# Altium schematic sheet Sheet1.SchDoc
size A4; SheetNumber: 1; SheetTotal: 1
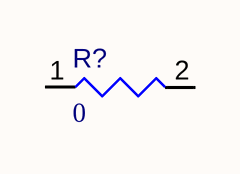
[diagram p0: Sheet1.SchDoc]

## Parts
R?  value 0  [RESC0402(1005)_L]  (hidden comment: 0R2J)

## Nets

Not connected (* = marked no-connect by the designer): R? 1 2

## Library data of the parts
R? = CMP-009-00062-2: Jumper 0402 (1005 Metric); Pins: 2; Mounting Technology: SMT; Case/Package: 0402